# EAGLE design MAC.PHY_shield (EAGLE 6.4)
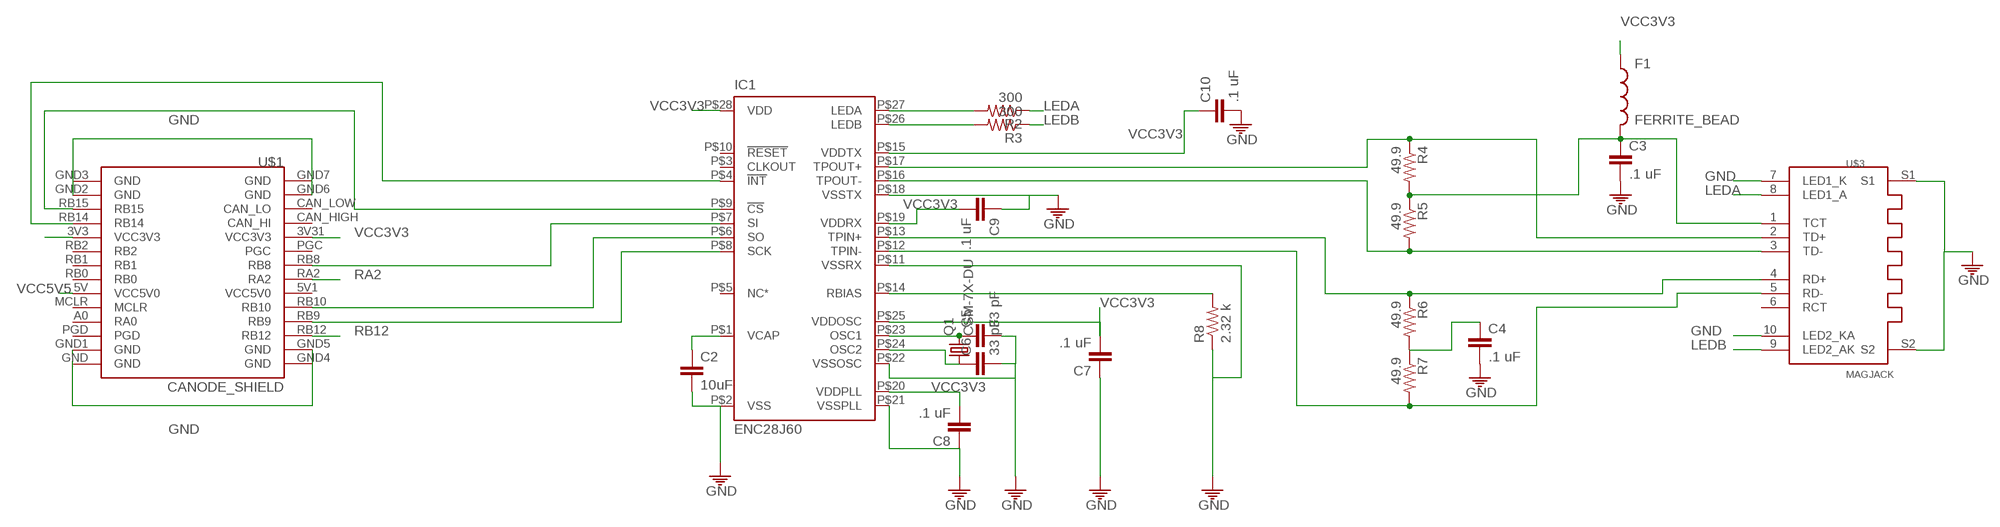
[diagram p0: schematic, sheet 1]

## Parts
C2  10uF  CAP1206  [1206]
C3  .1 uF  CAP1206  [1206]
C4  .1 uF  CAP1206  [1206]
C5  33 pF  CAP1206  [1206]
C6  33 pF  CAP1206  [1206]
C7  .1 uF  CAP1206  [1206]
C8  .1 uF  CAP1206  [1206]
C9  .1 uF  CAP1206  [1206]
C10  .1 uF  CAP1206  [1206]
F1  FERRITE_BEAD  [1206]
IC1  ENC28J60  [SOIC28-W]
Q1  CSM-7X-DU  [CSM-7X-DU]
R2  300  RESISTOR0805-RES  [0805]
R3  300  RESISTOR0805-RES  [0805]
R4  49.9  RESISTOR0805-RES  [0805]
R5  49.9  RESISTOR0805-RES  [0805]
R6  49.9  RESISTOR0805-RES  [0805]
R7  49.9  RESISTOR0805-RES  [0805]
R8  2.32 k  RESISTOR0805-RES  [0805]
U$1  CANODE_SHIELD  [CANODE_SHIELD]
U$3  MAGJACK  [08B0-1X1T-06-F]

## Nets
GND: C2.2 C3.2 C4.2 C5.2 C6.2 C7.1 C8.1 C9.1 C10.2 IC1.P$2(VSS) IC1.P$11(VSSRX) IC1.P$18(VSSTX) IC1.P$21(VSSPLL) IC1.P$22(VSSOSC) R8.1 U$1.GND U$1.GND1(GND) U$1.GND2(GND) U$1.GND3(GND) U$1.GND4(GND) U$1.GND5(GND) U$1.GND6(GND) U$1.GND7(GND) U$3.7(LED1_K) U$3.10(LED2_KA) U$3.S1 U$3.S2
LEDA: R2.1 U$3.8(LED1_A)
LEDB: R3.1 U$3.9(LED2_AK)
N$1: C2.1 IC1.P$1(VCAP)
N$2: IC1.P$27(LEDA) R2.2
N$3: IC1.P$26(LEDB) R3.2
N$4: C3.1 F1.2 R4.2 R5.1 U$3.1(TCT)
N$5: IC1.P$17(TPOUT+) R4.1 U$3.2(TD+)
N$6: IC1.P$16(TPOUT-) R5.2 U$3.3(TD-)
N$7: IC1.P$13(TPIN+) R6.1 U$3.4(RD+)
N$8: C4.1 R6.2 R7.1
N$9: IC1.P$12(TPIN-) R7.2 U$3.5(RD-)
N$10: IC1.P$9(!CS) U$1.RB15
N$11: IC1.P$14(RBIAS) R8.2
N$12: IC1.P$8(SCK) U$1.RB9
N$13: C5.1 IC1.P$23(OSC1) Q1.2
N$14: C6.1 IC1.P$24(OSC2) Q1.1
N$15: IC1.P$6(SO) U$1.RB10
N$16: IC1.P$7(SI) U$1.RB8
N$17: IC1.P$4(!INT) U$1.RB14
RA2: U$1.RA2
RB12: U$1.RB12
VCC3V3: C7.2 C8.2 C9.2 C10.1 F1.1 IC1.P$15(VDDTX) IC1.P$19(VDDRX) IC1.P$20(VDDPLL) IC1.P$25(VDDOSC) IC1.P$28(VDD) U$1.3V3(VCC3V3) U$1.3V31(VCC3V3)
VCC5V5: U$1.5V(VCC5V0)
Unconnected: IC1.P$3(CLKOUT) IC1.P$5(NC*) IC1.P$10(!RESET) U$1.5V1(VCC5V0) U$1.A0(RA0) U$1.CAN_HIGH(CAN_HI) U$1.CAN_LOW(CAN_LO) U$1.MCLR U$1.PGC U$1.PGD U$1.RB0 U$1.RB1 U$1.RB2 U$3.6(RCT)

## Library data of the parts
C2-C10 = ASL:CAP: Capacitor Standard 0603 ceramic capacitor, and 0.1" leaded capacitor.
F1 = ASL:FERRITE_BEAD
IC1 = ASL:ENC28J60: Stand-Alone Ethernet Controller with SPI Interface Source: http://ww1.microchip.com/downloads/en/DeviceDoc/39662c.pdf
Q1 = crystal:CSM-7X-DU: SMD CRYSTAL Source: www.ecsxtal.com .. Crystal 3.6864MHz CSM_7X_DU.PDF; OC_FARNELL: unknown; OC_NEWARK: unknown
R2-R8 = ASL:RESISTOR: Resistor Basic schematic elements and footprints for 0603, 1206, and PTH resistors.
U$1 = ASL:CANODE_SHIELD: This part provides an outline of the CANode to facilitate developing shield boards. Note that this does not show the position of the mounting holes for the 4-40 screws, which should be .12" holes centered in the 4 circles in the corners.
U$3 = ASL:MAGJACK

## Board
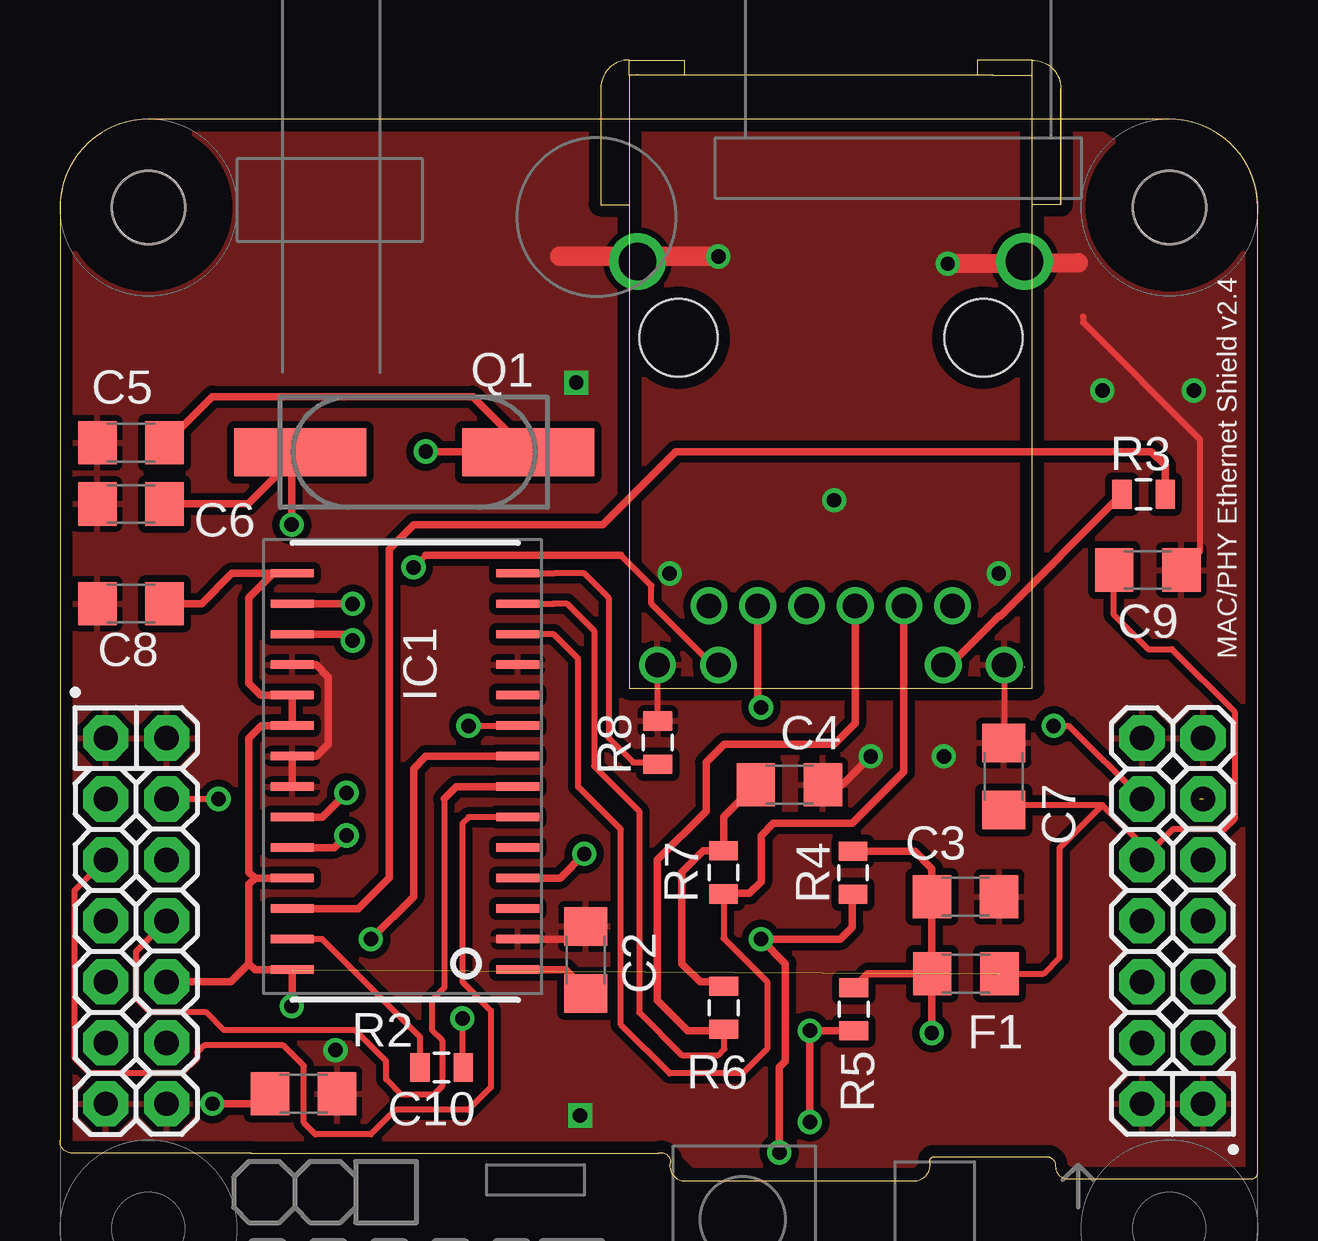
[diagram p1: board, top side]
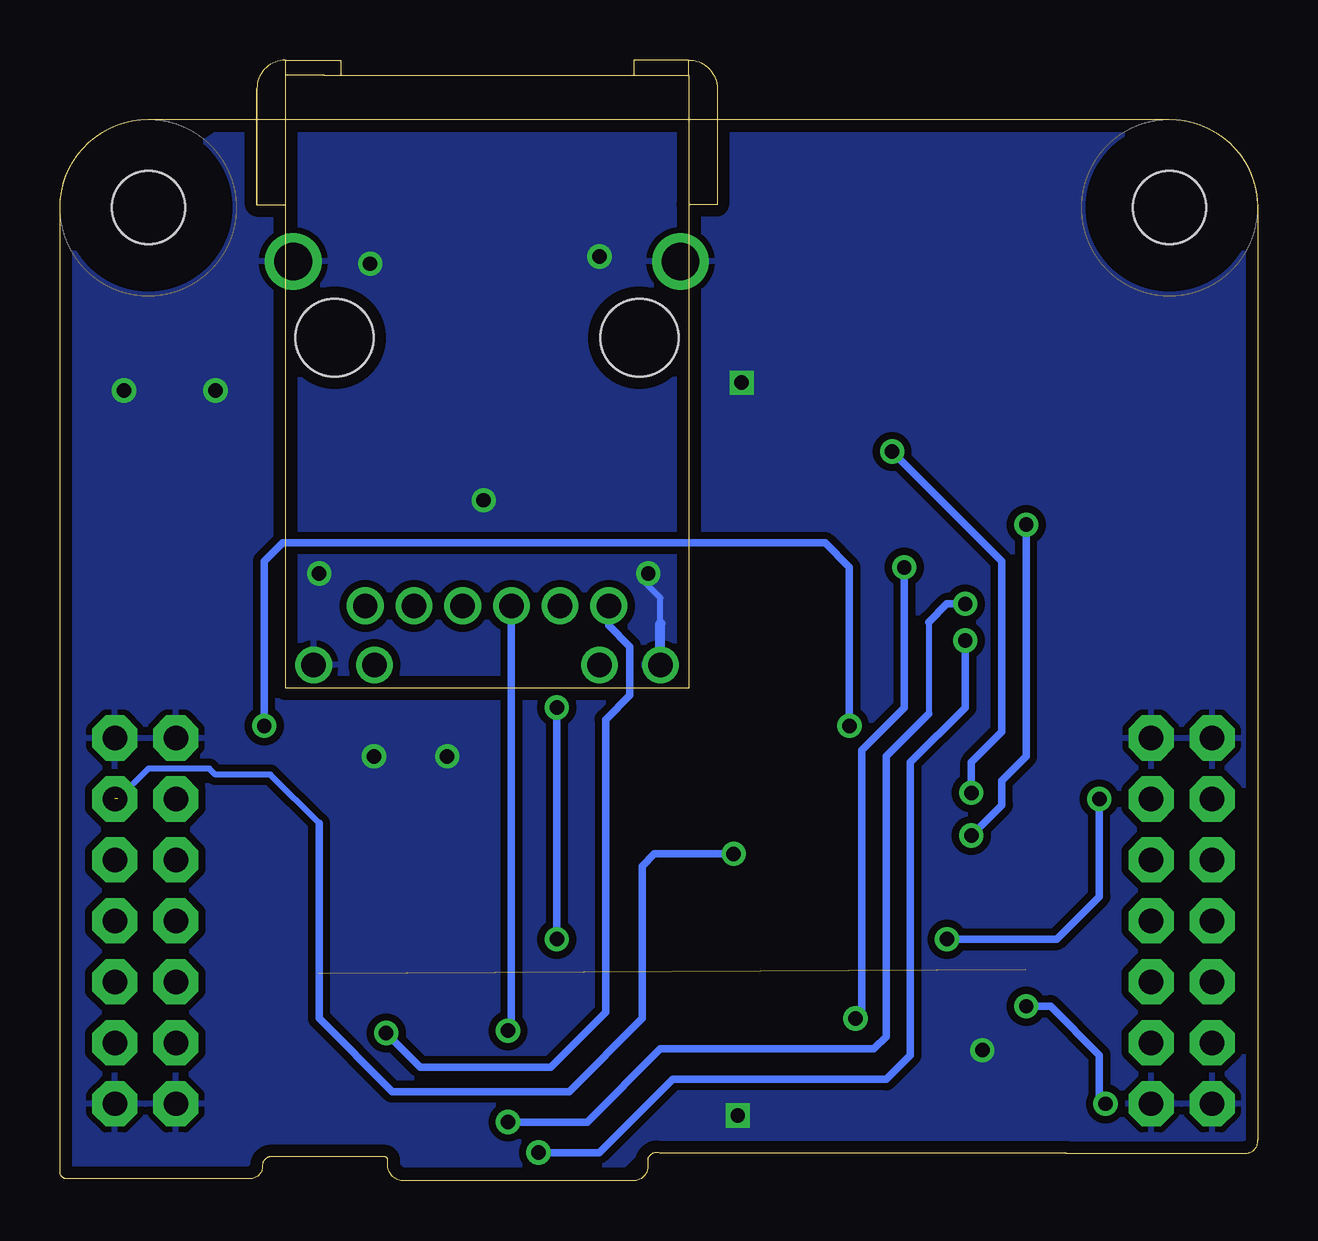
[diagram p2: board, bottom side, seen from below]

Size 49.91 x 46.69 mm. Coordinates in mm from the lower left corner, seen from the top.
Outline: 7.98,1.14 24.92,1.14 arc-90 25.43,0.89 25.43,0.74 arc90 25.91,0 35.71,0 arc90 36.25,0.79 36.25,0.84 arc-90 36.4,0.99 41.12,0.99 arc-90 41.48,0.64 41.48,0.58 arc90 41.99,0.08 49.63,0.08 arc90 49.91,0.36 49.91,40.54 arc90 46.23,44.22 3.68,44.22 arc90 0,40.54 0,1.68 0,1.64 arc90 0.49,1.15 7.98,1.15
Copper layers (1*16): Top 0.035mm / dielectric 1.5mm / Bottom 0.035mm
Design rules "default": minimum track width 10mil, minimum drill 24mil, track to track 8mil, track to pad 8mil, pad to pad 8mil, via to via 8mil, smd to smd 8mil, copper to edge 0.5mm, drill to drill 8mil, minimum pad ring 10mil, minimum via ring 8mil, stop-mask expansion 4mil, vias tented up to drill 0mil, thermal gap 10mil

### Footprints (pad centres in the part's own frame; a part is rotated, then mirrored left to right if it is on the bottom)
1206 = smd 1.6 x 1.8: 1 -1.4,0; 2 1.4,0
STAND-OFF-TIGHT = hole 3.048: 0,0
SOIC28-W = smd 1.8 x 0.35: P$1 -4.6,8.4; P$2 -4.6,7.13; P$3 -4.6,5.86; P$4 -4.6,4.59; P$5 -4.6,3.32; P$6 -4.6,2.05; P$7 -4.6,0.78; P$8 -4.6,-0.49; P$9 -4.6,-1.76; P$10 -4.6,-3.03; P$11 -4.6,-4.3; P$12 -4.6,-5.57; P$13 -4.6,-6.84; P$14 -4.6,-8.11; P$15 4.8,-8.11; P$16 4.8,-6.84; P$17 4.8,-5.57; P$18 4.8,-4.3; P$19 4.8,-3.03; P$20 4.8,-1.76; P$21 4.8,-0.49; P$22 4.8,0.78; P$23 4.8,2.05; P$24 4.8,3.32; P$25 4.8,4.59; P$26 4.8,5.86; P$27 4.8,7.13; P$28 4.8,8.4
CSM-7X-DU = smd 5.5 x 2: 1 -4.75,0; 2 4.75,0
0805 = smd 0.8 x 1.2: 1 -0.9,0; 2 0.9,0
CANODE_SHIELD = drill 1.016 pad 1.88 octagon: 3V3 45.085,19.05; 3V31 4.445,13.97; 5V 45.085,13.97; 5V1 4.445,19.05; A0 45.085,11.43; CAN_HIGH 1.905,11.43; CAN_LOW 4.445,11.43; GND 45.085,24.13; GND1 47.625,24.13; GND2 45.085,8.89; GND3 47.625,8.89; GND4 4.445,8.89; GND5 1.905,8.89; GND6 4.445,24.13; GND7 1.905,24.13; MCLR 47.625,13.97; PGC 1.905,13.97; PGD 47.625,11.43; RA2 1.905,16.51; RB0 47.625,16.51; RB1 45.085,16.51; RB2 47.625,19.05; RB8 4.445,16.51; RB9 4.445,21.59; RB10 1.905,19.05; RB12 1.905,21.59; RB14 47.625,21.59; RB15 45.085,21.59
08B0-1X1T-06-F = drill 1.02: 1 2.15,2.46; 2 4.18,2.46; 3 6.21,2.46; 4 8.24,2.46; 5 10.27,2.46; 6 12.3,2.46; 7 0,0; 8 2.54,0; 9 11.91,0; 10 14.45,0 | drill 1.57: S1 -0.83,16.808; S2 15.3,16.809 | hole 3.25: 0.88,13.63; 13.58,13.63

### Placement (x,y rotation side)
C2  21.91,9.19 90 top
C3  37.73,11.82 0 top
C4  30.39,16.5 0 top
C5  2.96,30.75 180 top
C6  2.96,28.19 180 top
C7  39.32,16.84 270 top
C8  2.96,24.04 0 top
C9  45.33,25.44 180 top
C10  10.15,3.62 0 top
E$3  [STAND-OFF-TIGHT]  3.68,40.54 0 top
E$4  [STAND-OFF-TIGHT]  46.23,40.54 0 top
F1  37.74,8.62 180 top
IC1  14.48,17.2 180 top
Q1  14.76,30.35 0 top
R2  15.9,4.71 180 top
R3  45.15,28.6 0 top
R4  33.05,12.83 90 top
R5  33.07,7.14 270 top
R6  27.66,7.2 90 top
R7  27.65,12.84 270 top
R8  24.9,18.25 270 top
U$1  0,-5.69 0 top
U$3  24.89,21.49 0 top

### Tracks (layer width: path | path; a pad name or v marks a point on that pad's centre or on a via)
GND  (via drill 0.6)
  Top 0.254: U$3.7 24.89,19.16 R8.1 | U$3.10 39.34,18.26 C7.1 | C9.1 47.5,26.21 47.5,30.89 42.63,35.76 42.63,36.01
  Top 0.305: IC1.P$2 19.07,10.06 21.37,10.06 C2.2 | IC1.P$18 9.68,21.49 10.67,21.49 11.18,20.98 11.18,18.19 10.68,17.69 IC1.P$21 IC1.P$22 | C4.2 32.6,16.5 v33.78,17.68
  Top 0.813: 20.83,38.51 v27.43,38.51 | v36.99,38.2 42.42,38.25
  Bottom 0.254: U$3.7 24.89,24.28 25.65,25.04
  Bottom 0.406: U$3.7 24.9,23.22
  other vias: 11.48,5.44 36.83,17.68 43.43,32.92 47.24,32.92 32.26,28.35 25.4,25.3 39.12,25.3 21.51,33.25 21.67,2.71
  pour Bottom (isolate 0.305): 4.06,43.59 0.51,40.28 0.51,34.95 0.25,1.68 25.4,1.68 26.42,0.66 35.56,0.66 36.32,1.42 41.4,1.42 42.42,0.41 49.53,0.41 49.53,39.78 43.43,43.59
  pour Top (isolate 0.305): 4.06,43.59 0.51,40.28 0.51,34.95 0.25,1.68 25.4,1.68 26.42,0.66 35.56,0.66 36.32,1.42 41.4,1.42 42.42,0.41 49.53,0.41 49.53,39.78 43.43,43.59
LEDA  (via drill 0.6)
  Top 0.254: U$3.8 27.18,21.49 24.64,24.03 24.64,24.79 23.37,26.06 | 15.24,26.06 v14.73,25.55 | v16.76,6.76 16.76,4.75 R2.1
  Top 0.305: 23.37,26.06 15.24,26.06
  Bottom 0.305: v14.73,25.55 14.73,19.71 16.51,17.93 16.51,7.01 v16.76,6.76
LEDB
  Top 0.305: U$3.9 37.08,21.49 39.12,23.52 39.17,23.52 R3.1
N$1
  Top 0.305: C2.1 21.91,7.96 21.08,8.79 19.09,8.79 IC1.P$1
N$2
  Top 0.254: R2.2 15,5.98 10.92,10.06 9.68,10.06 IC1.P$27
N$3
  Top 0.305: R3.2 46.05,29.8 45.47,30.38 25.65,30.38 22.61,27.33 14.73,27.33 13.72,26.31 13.72,12.62 12.42,11.33 9.68,11.33 IC1.P$26
N$4  (via drill 0.6)
  Top 0.305: F1.2 33.66,8.62 R5.1 | R4.2 33.06,13.72 35.61,13.72 36.33,13 C3.1 36.33,8.64 F1.2 | v36.32,6.15 36.32,8.6 F1.2
  Bottom 0.305: v36.32,6.15 34.9,4.72 29.46,4.72 27.18,7.01 27.18,19.2 26.16,20.22 26.16,22.25 27.04,23.13 U$3.1
N$5  (via drill 0.6)
  Top 0.305: U$3.2 29.07,19.85 v29.21,19.71 | R4.1 33.02,11.9 33.02,10.57 32.51,10.06 v29.21,10.06 30.23,9.04 30.23,4.98 29.97,4.72 v29.97,1.17 | IC1.P$17 11.93,22.77 v12.19,22.5
  Bottom 0.305: v29.21,19.71 v29.21,10.06 | v29.97,1.17 27.43,1.17 24.38,4.22 15.49,4.22 14.48,5.23 14.48,17.42 12.19,19.71 v12.19,22.5
N$6  (via drill 0.6)
  Top 0.305: R5.2 v31.24,6.25 v31.24,2.44 | IC1.P$16 v12.18,24.04 v12.19,24.03
  Bottom 0.254: 13.72,23.27 13.72,19.46
  Bottom 0.305: U$3.3 31.1,6.39 v31.24,6.25 | v12.19,24.03 12.95,24.03 13.72,23.27 | v31.24,2.44 27.94,2.44 24.89,5.49 16,5.49 15.49,5.99 15.49,17.68 13.72,19.46
N$7
  Top 0.254: IC1.P$13 20.57,24.04 20.57,24.03 21.13,24.03 22.25,22.91 22.25,17.27 24.13,15.39 24.13,7.01 25.91,5.23 27.43,5.23 27.69,5.49 27.69,6.28 R6.1
  Top 0.305: U$3.4 33.13,19.06 32.26,18.19 27.69,18.19 26.92,17.42 26.92,15.39 24.89,13.36 24.89,7.52 26.16,6.25 27.61,6.25 R6.1
N$8
  Top 0.305: C4.1 27.65,15.15 R7.1 26.79,13.74 25.91,12.85 25.91,9.04 26.67,8.28 27.48,8.28 R6.2
N$9
  Top 0.254: R7.2 27.65,10.1 29.46,8.28 29.46,5.49 28.45,4.47 25.4,4.47 23.37,6.5 23.37,14.63 21.59,16.41 21.59,21.74 20.57,22.76 19.09,22.76 IC1.P$12
  Top 0.305: U$3.5 35.16,17.03 33.02,14.88 29.72,14.88 29.21,14.38 29.21,12.45 28.73,11.96 27.67,11.96 R7.2
N$10  (via drill 0.6)
  Top 0.254: v17.02,18.95 19.07,18.95 IC1.P$9 | v41.4,18.95 42.04,18.95 U$1.RB15
  Bottom 0.305: v41.4,18.95 41.4,25.81 40.64,26.57 18.03,26.57 17.02,25.55 v17.02,18.95
N$11
  Top 0.254: IC1.P$14 20.57,25.31 20.57,25.3 21.84,25.3 22.86,24.28 22.86,18.44 23.88,17.42 24.83,17.42 R8.2
N$12  (via drill 0.6)
  Top 0.254: U$1.RB9 v6.6,15.9
  Top 0.305: IC1.P$8 15.25,17.69 14.73,17.17 14.73,11.84 v12.95,10.06
  Bottom 0.305: v12.95,10.06 8.38,10.06 6.6,11.84 v6.6,15.9
N$13  (via drill 0.6)
  Top 0.305: C5.1 4.43,30.75 6.35,32.66 17.2,32.66 Q1.2 19.48,30.38 v15.24,30.38 | IC1.P$23 10.93,15.15 v11.94,16.15
  Bottom 0.305: v11.94,16.15 11.94,17.42 10.67,18.69 10.67,25.81 v15.24,30.38
N$14  (via drill 0.6)
  Top 0.305: C6.1 7.85,28.19 Q1.1 9.65,30 v9.65,27.33 | IC1.P$24 11.44,13.88 v11.94,14.38
  Bottom 0.305: v11.94,14.38 10.67,15.65 10.67,16.66 9.65,17.68 v9.65,27.33
N$15
  Top 0.254: IC1.P$6 17.02,15.15 16.76,14.88 16.76,8.28 17.96,7.09 17.96,3.89 17.02,2.95 13.97,2.95 12.95,1.93 10.64,1.93 10.16,2.41 10.16,4.78 9.3,5.64 6.02,5.64 5.71,5.33 5.71,5.11 5.08,4.47 1.24,4.47 0.61,5.11 0.61,12.09 U$1.RB10
N$16
  Top 0.254: 16,15.9 16,8.03 15.49,7.52 15.49,6.27 15.93,5.84 15.93,3.94 15.57,3.58 14.22,3.58 13.59,4.22 13.59,4.98 12.29,6.27 6.83,6.27 6.1,7.01 3.76,7.01 3.18,7.59 3.18,9.55 U$1.RB8
  Top 0.305: IC1.P$7 16.52,16.42 16,15.9
N$17  (via drill 0.6)  (1 unrouted)
  Top 0.305: IC1.P$4 20.84,12.61 v21.84,13.61
  Bottom 0.254: 39.12,14.88 41.15,16.92 43.43,16.92 43.69,17.17 46.23,17.17 47.5,15.9
  Bottom 0.305: v21.84,13.61 25.15,13.61 25.65,13.11 25.65,6.76 28.7,3.71 36.07,3.71 39.12,6.76 39.12,14.88
VCC3V3  (via drill 0.6)  (1 unrouted)
  Top 0.254: 43.43,15.65 39.53,15.65 C7.2 | C9.2 43.92,25.43 43.92,23.57 45.34,22.15 46.33,22.15 48.95,19.53 48.95,15.06 48.51,14.63 46.36,14.63 U$1.3V3 45.08,14 43.43,15.65 | F1.1 40.98,8.62 41.66,9.3 41.66,13.87 43.43,15.65
  Top 0.305: C8.2 5.91,24.04 7.16,25.3 8.89,25.3 | 8.89,25.3 9.67,25.3 IC1.P$15 | 8.89,25.3 7.87,24.28 7.87,20.73 8.38,20.23 IC1.P$19 IC1.P$20 8.39,18.96 7.87,18.44 7.87,12.85 8.13,12.6 | 9.4,12.6 9.67,12.6 IC1.P$25 9.41,12.61 9.4,12.6 | 9.4,12.6 8.13,12.6 | 8.13,12.6 7.87,12.34 7.87,9.04 | v9.65,7.26 9.68,7.29 IC1.P$28 9.67,8.79 8.13,8.79 7.87,9.04 | v6.35,3.2 8.33,3.2 C10.1 | U$1.3V31 7.11,8.28 7.87,9.04
  Bottom 0.305: v9.65,7.26 8.64,7.26 6.6,5.23 6.6,3.45 v6.35,3.2

### Text on the board
tPlace: v2.4 | MAC/PHY Ethernet Shield